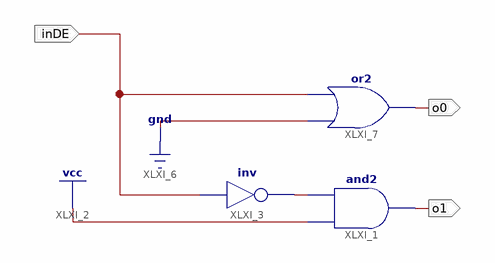
[diagram p0: schematic sheet 1]
// Xilinx ISE schematic decoder1_2_cm.sch (spartan6) as structural Verilog: 3 symbols, 3 ports
module decoder1_2_cm (
  input  inDE,
  output o0,
  output o1
);

  wire XLXN_10;

  and XLXI_1 (o1, 1'b1, XLXN_10);
  not XLXI_3 (XLXN_10, inDE);
  or XLXI_7 (o0, 1'b0, inDE);
endmodule
